# Altium schematic sheet schematic_GSM_01.SchDoc
size 381 x 241 mm; SheetNumber: 1
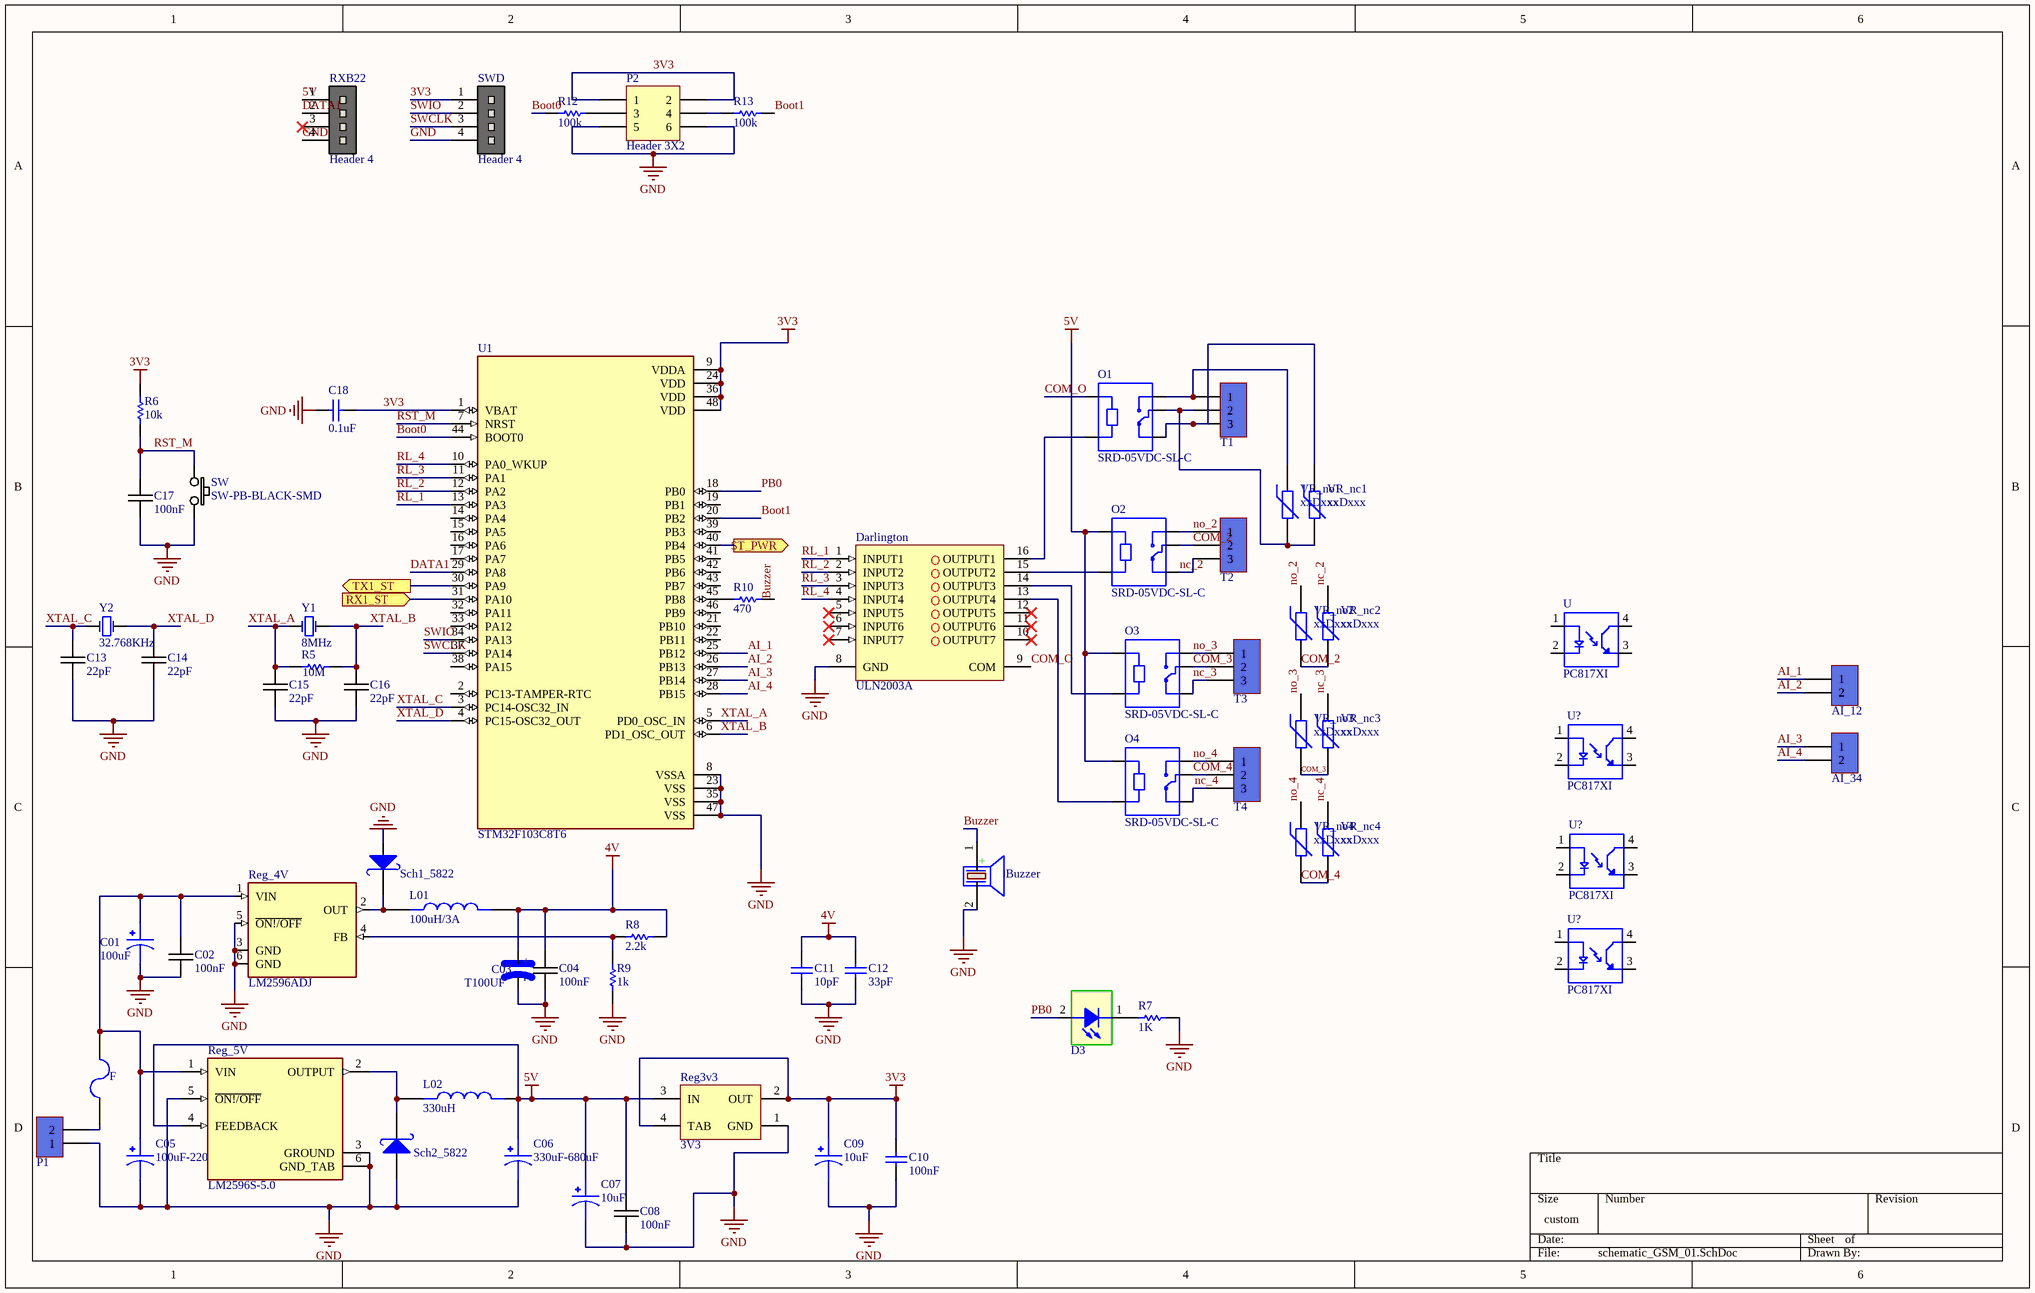
[diagram p0: schematic_GSM_01.SchDoc]

## Parts
(Parts that share a designator on the sheet are numbered #1, #2 ... from top to bottom, then left to right.)
AI_12  KF301_Terminal  [KF301 2PIN]  (value not drawn)
AI_34  KF301_Terminal  [KF301 2PIN]  (value not drawn)
Buzzer  (no value)  [BUZZER 7.62mm DC]
C01  100uF  [CAPAE1050X1050N]
C02  100nF  [0805C-TBD]
C03  T100UF  [AVX-B]
C04  100nF  [0805C-TBD]
C05  100uF-220uF  [CAPAE1050X1050N]
C06  330uF-680uF  [CAPAE1050X1050N]
C07  10uF  [CAPAE1050X1050N]
C08  100nF  [0805C-TBD]
C09  10uF  [CAPAE1050X1050N]
C10  100nF  [CAPC3413X12N]
C11  10pF  [CAPC3413X12N]
C12  33pF  [CAPC3413X12N]
C13  22pF  [0805C-TBD]
C14  22pF  [0805C-TBD]
C15  22pF  [0805C-TBD]
C16  22pF  [0805C-TBD]
C17  100nF  [0805C-TBD]
C18  0.1uF  [CAPC3413X12N]
D3  SMD 1206 LED  [LED 1206]  (value not drawn)
Darlington  ULN2003A  [SO16_N]
F  F=1.0 A  [1206 FUSE]  (value not drawn)
L01  100uH/3A  [IND_SCIHP1367-100M]
L02  330uH  [IND_SCIHP1367-100M]
O1  SRD-05VDC-SL-C  [RELAY_SRD-05VDC-SL-C]
O2  SRD-05VDC-SL-C  [RELAY_SRD-05VDC-SL-C]
O3  SRD-05VDC-SL-C  [RELAY_SRD-05VDC-SL-C]
O4  SRD-05VDC-SL-C  [RELAY_SRD-05VDC-SL-C]
P1  KF301_Terminal  [KF301 2PIN]  (value not drawn)
P2  Header 3X2  [HDR2X3]
R5  10M  [RESC3413X04N]
R6  10k  [RESC3413X04N]
R7  1K  [RESC3413X04N]
R8  2.2k  [RESC3413X04N]
R9  1k  [RESC3413X04N]
R10  470  [RESC3413X04N]
R12  100k  [RESC3413X04N]
R13  100k  [RESC3413X04N]
Reg3v3  3V3  [SOT223]
Reg_4V  LM2596ADJ  [LM2596ADJ]
Reg_5V  LM2596S-5.0  [TO170P1524X483-6N]
RXB22  Header 4  [HDR 1X4]
Sch1_5822  1n5822  [DO-214AB(SMC)]  (value not drawn)
Sch2_5822  1n5822  [DO-214AB(SMC)]  (value not drawn)
SW  SW-PB-BLACK-SMD  [SW-PB-SMD]
SWD  Header 4  [HDR 1X4]
T1  KF301_Terminal  [KF301 3PIN]  (value not drawn)
T2  KF301_Terminal  [KF301 3PIN]  (value not drawn)
T3  KF301_Terminal  [KF301 3PIN]  (value not drawn)
T4  KF301_Terminal  [KF301 3PIN]  (value not drawn)
U  PC817XI  [SOIC254P975X460-4N]
U1  STM32F103C8T6  [QFP50P900X900X160-48N]
U?#1  PC817XI  [SOIC254P975X460-4N]
U?#2  PC817XI  [SOIC254P975X460-4N]
U?#3  PC817XI  [SOIC254P975X460-4N]
VR_nc1  xxDxxx  [07D XXX]
VR_nc2  xxDxxx  [07D XXX]
VR_nc3  xxDxxx  [07D XXX]
VR_nc4  xxDxxx  [07D XXX]
VR_no1  xxDxxx  [07D XXX]
VR_no2  xxDxxx  [07D XXX]
VR_no3  xxDxxx  [07D XXX]
VR_no4  xxDxxx  [07D XXX]
Y1  8MHz  [Crystal SMD]
Y2  32.768KHz  [Crystal SMD]

## Ports
RX1_ST (in), ST_PWR (out), TX1_ST (out)

## Nets
3V3: C09.1 C10.1 C18.2 P2.1 P2.2 R6.1 Reg3v3.2(OUT) Reg3v3.4(TAB) SWD.1 U1.1(VBAT) U1.9(VDDA) U1.24(VDD) U1.36(VDD) U1.48(VDD)
4V: C03.POS C04.1 C11.1 C12.1 L01.2 R8.1
5V: C06.1 C07.1 C08.1 L02.2 O2.A1 O3.A1 O4.A1 Reg3v3.3(IN) Reg_5V.4(FEEDBACK) RXB22.1
GND: Buzzer.2(-) C01.2 C02.2 C03.NEG C04.2 C05.2 C06.2 C07.2 C08.2 C09.2 C10.2 C11.2 C12.2 C13.2 C14.2 C15.2 C16.2 C17.2 C18.1 Darlington.8(GND) P1.1 P2.5 P2.6 R7.2 R9.2 Reg3v3.1(GND) Reg_4V.3(GND) Reg_4V.5(~{ON!/OFF}) Reg_4V.6(GND) Reg_5V.3(GROUND) Reg_5V.5(~{ON!/OFF}) Reg_5V.6(GND_TAB) RXB22.4 Sch1_5822.1(A) Sch2_5822.1(A) SW.2 SWD.4 U1.8(VSSA) U1.23(VSS) U1.35(VSS) U1.47(VSS)
AI_1: AI_12.1 U1.25(PB12)
AI_2: AI_12.2 U1.26(PB13)
AI_3: AI_34.1 U1.27(PB14)
AI_4: AI_34.2 U1.28(PB15)
Boot0: R12.2 U1.44(BOOT0)
Boot1: R13.1 U1.20(PB2)
Buzzer: Buzzer.1(+) R10.2
COM_2: O2.COM T2.2 VR_nc2.2 VR_no2.2
COM_3: O3.COM T3.2 VR_nc3.2 VR_no3.2
COM_4: O4.COM T4.2 VR_nc4.2 VR_no4.2
COM_O: Darlington.9(COM) O1.A1
DATA1: RXB22.2 U1.29(PA8)
nc_2: O2.NC T2.3 VR_nc2.1
nc_3: O3.NC T3.3 VR_nc3.1
nc_4: O4.NC T4.3 VR_nc4.1
no_2: O2.NO T2.1 VR_no2.1
no_3: O3.NO T3.1 VR_no3.1
no_4: O4.NO T4.1 VR_no4.1
PB0: D3.2 U1.18(PB0)
RL_1: Darlington.1(INPUT1) U1.13(PA3)
RL_2: Darlington.2(INPUT2) U1.12(PA2)
RL_3: Darlington.3(INPUT3) U1.11(PA1)
RL_4: Darlington.4(INPUT4) U1.10(PA0_WKUP)
RST_M: C17.1 R6.2 SW.1 U1.7(NRST)
RX1_ST: U1.31(PA10) ; port RX1_ST
ST_PWR: U1.40(PB4) ; port ST_PWR
SWCLK: SWD.3 U1.37(PA14)
SWIO: SWD.2 U1.34(PA13)
TX1_ST: U1.30(PA9) ; port TX1_ST
XTAL_A: C15.1 R5.1 U1.5(PD0_OSC_IN) Y1.1(OSC1)
XTAL_B: C16.1 R5.2 U1.6(PD1_OSC_OUT) Y1.2(OSC2)
XTAL_C: C13.1 U1.3(PC14-OSC32_IN) Y2.1(OSC1)
XTAL_D: C14.1 U1.4(PC15-OSC32_OUT) Y2.2(OSC2)
NetC01_1: C01.1 C02.1 C05.1 F.1 Reg_4V.1(VIN) Reg_5V.1(VIN)
NetD3_1: D3.1 R7.1
NetDarlington_13: Darlington.13(OUTPUT4) O4.A2
NetDarlington_14: Darlington.14(OUTPUT3) O3.A2
NetDarlington_15: Darlington.15(OUTPUT2) O2.A2
NetDarlington_16: Darlington.16(OUTPUT1) O1.A2
NetF_2: F.2 P1.2
NetL01_1: L01.1 Reg_4V.2(OUT) Sch1_5822.2(K)
NetL02_1: L02.1 Reg_5V.2(OUTPUT) Sch2_5822.2(K)
NetO1_COM: O1.COM T1.2 VR_nc1.2 VR_no1.2
NetO1_NC: O1.NC T1.3 VR_nc1.1
NetO1_NO: O1.NO T1.1 VR_no1.1
NetP2_3: P2.3 R12.1
NetP2_4: P2.4 R13.2
NetR8_2: R8.2 R9.1 Reg_4V.4(FB)
NetR10_1: R10.1 U1.45(PB8)

Not connected (* = marked no-connect by the designer): Darlington 5(INPUT5)* 6(INPUT6)* 7(INPUT7)* 10(OUTPUT7)* 11(OUTPUT6)* 12(OUTPUT5)*; RXB22 3*; U 1(A) 2(C) 3(ET) 4(CT); U1 2(PC13-TAMPER-RTC) 14(PA4) 15(PA5) 16(PA6) 17(PA7) 19(PB1) 21(PB10) 22(PB11) 32(PA11) 33(PA12) 38(PA15) 39(PB3) 41(PB5) 42(PB6) 43(PB7) 46(PB9); U?#1 1(A) 2(C) 3(ET) 4(CT); U?#2 1(A) 2(C) 3(ET) 4(CT); U?#3 1(A) 2(C) 3(ET) 4(CT)

## Notes on the sheet
- (in symbol TANTALUM-SMD-100UF-6.3V(AVX-B)) +; -

## Library data of the parts
AI_12 AI_34 P1 = KF301-2Pin_Terminal: Terminal 2 Pin 250VAC 16A; Part. No: KF301 2P; Designer: Abbas Basereh; Link: https://www.aliexpress.com/item/
Buzzer = PIEZO BUZZER: PIEZO BUZZER ACTIVE; Designer: Abbas Basereh; Comment_1: SPEAKER AND BEEP; Design Date: 1395/11/14; ComponentLink2Description: Reference; PackageDescription: THD; Publisher: Abbas Basereh; Mounting Technology: THD; Pin Count: 2; Status: Unreleased
C01 C05 C06 C07 C09 = MAL214699103E3: 100ÂµF 50V Aluminum Electrolytic Capacitors Radial, Can - SMD 1500 Hrs @ 125Â°C; MF: Vishay BC; MP: MAL214699103E3; SnapEDA_Link: https://www.snapeda.com/parts/MAL214699103E3/Vishay%20BC%20Components/view-part/285948/?ref=snap; Value: *; Digi-Key_Part_Number: 4437PHCT-ND; Mouser-Purchase-URL: https://snapeda.com/shop?store=Mouser&id=285948; DigiKey-Purchase-URL: https://snapeda.com/shop?store=DigiKey&id=285948; Package: Radial Vishay BC
C02 C04 C08 C13-C17 = 0805C-100nF-25V-X7R-MUR: CAPACITOR 0805 CERAMIC; Supplier 1: Digi-Key; Supplier Part Number 1: 490-1673-1-ND
C03 = TANTALUM-SMD-100UF-6.3V(AVX-B): 100ÂµF Molded Tantalum Capacitors 6.3V 1411 _3528 Metric_, 1210 1.7Ohm; MF: AVX Interconnect / Elco; MP: TAJB107M006RNJ; Value: *; Package: 1210 AVX Interconnect / Elco; SnapEDA_Link: https://www.snapeda.com/parts/TAJB107M006RNJ/AVX%20Interconnect%20/%20Elco/view-part/105606/?ref=snap; Price: None; Availability: Unavailable
C10-C12 C18 = CAP SMD 0805: CAP 0805; Designer: Abbas Basereh; Desc.: CAP SMD 0805; Data: 16-12-2016
D3 = LED SMD 1206
Darlington = ULN2003A: SEVEN DARLINGTON ARRAYS; Published: 2017-3-2; DatasheetVersion: STMicroelectronics GROUP OF COMPANIES; PackageVersion: 2017-3-2; PackageReference: SO16_N; Publisher: Abbas Basereh; PackageDescription: 16-Pin Small Outline Integrated Circuit 1.27 mm Pitch, IPC High Density; Supplier 1: Digi-Key; Supplier Part Number 1: ULN2003A; Supplier 2: Mouser; Supplier Part Number 2: ULN2003A; ComponentLink1Description: Datasheet; ComponentLink2URL: http://www.st.com
F = Fuse SMD1206: SMD Fuses 1206; Designer: Abbas Basereh; Desc.: SMD Fuses 1206; Data: 16-12-2016
L01 L02 = SCIHP1367-4R7M: High Current Shielded SMD Power Inductor | Inductance 4.7uH | Test Frequency 200KHz | DC Resistance 0.0112? | Saturation Current 25A | Temperature Current 13.5A | Max Height 6.7mm; MF: Signal Transformer; Price: None; Check_prices: https://www.snapeda.com/parts/SCIHP1367-4R7M/Signal%20Transformer/view-part/1550067/?ref=eda; SnapEDA_Link: https://www.snapeda.com/parts/SCIHP1367-4R7M/Signal%20Transformer/view-part/1550067/?ref=snap; Package: Nonstandard Signal Transformers; Availability: Bad; MP: SCIHP1367-4R7M; Value: *
O1-O4 = SRD-05VDC-SL-C: 5V Trigger Relay Module For Arduino And Raspberry Pi 5V Trigger Relay Module For Arduino And Raspberry Pi; MF: Songle Relay; Package: None; Availability: Unavailable; Value: *; MP: SRD-05VDC-SL-C; SnapEDA_Link: https://www.snapeda.com/parts/SRD-05VDC-SL-C/Songle%20Relay/view-part/1029484/?ref=snap; Price: None
P2 = Header 3X2: Header, 3-Pin, Dual row; LatestRevisionDate: 17-Jul-2002; LatestRevisionNote: Re-released for DXP Platform.; Publisher: Altium Limited
R5-R10 R12 R13 = RES 0805 0.125W: RES 0805; Designer: Abbas Basereh; Desc.: RES SMD 0805; Data: 16-12-2016
Reg3v3 = AMS1117-x.x: x.x Volt, 800mA Low-Dropout Linear Regulator, 4-pin SOT-223; Designer: Ali Hafizi; Data: 16-12-2016
Reg_4V = LM2596ADJ: MP: LM2596-ADJ; MF: First Components; SnapEDA_Link: https://www.snapeda.com/parts/LM2596-ADJ/First%20Components/view-part/557542/?ref=snap; Availability: Unavailable; Price: None; Value: *; Package: None
Reg_5V = LM2596S-5.0: SIMPLE SWITCHER&reg; 4.5V to 40V, 3A Low Component Count Step-Down Regulator 5-DDPAK/TO-263; MF: Texas Instruments; MP: LM2596S-5.0/NOPB; DigiKey-Purchase-URL: https://snapeda.com/shop?store=DigiKey&id=15588; Mouser-Purchase-URL: https://snapeda.com/shop?store=Mouser&id=15588; SnapEDA_Link: https://www.snapeda.com/parts/LM2596S-5.0/NOPB/Texas%20Instruments/view-part/15588/?ref=snap; Price: None; Value: *; Availability: Good; Texas_Instruments-Purchase-URL: https://snapeda.com/shop?store=Texas+Instruments&id=15588; Package: TO-263-5 Texas Instruments
RXB22 SWD = Header 4: Header, 4-Pin
Sch1_5822 Sch2_5822 = 1N5822 SMD: Schottky Rectifiers; Part. No: SS34; Manufacturer: ON Semiconductor/Fairchild; Designer: Abbas Basereh; Link: https://www.aliexpress.com/item/Free-shipping-100pcs-1n5822-sma-smd-do-214ac-Schottky-diode-ss34/32337482329.html?spm=2114.01010208.3.1.zLZDsP&ws_ab_test=searchweb0_0,searchweb201602_4_10065_10068_10084_10083_10080_10082_10081_10060_10061_10062_10056_10055_10054_10059_10099_10078_10079_427_10073_10103_10102_10096_10052_10050_10051,searchweb201603_4&btsid=6e50dc92-ac69-45bc-a19e-209af19ce602; Link: http://www.tme.eu/en/details/ss34/smd-schottky-diodes/vishay/ss34-e357t/; Link: http://www.digikey.com/product-detail/en/on-semiconductor-fairchild/SS34/SS34FSCT-ND/2094459; Data: 16-12-2016
SW = SW-PB-BLACK-SMD: PUSHBUTTON SWITCH 6MM SMD
T1-T4 = KF301-3Pin_Terminal: Terminal 3 Pin 250VAC 16A; Part. No: KF301 3P; Designer: Abbas Basereh; Link: https://www.aliexpress.com/item/
U U?#1-U?#3 = PC817XI: Optoisolator Transistor Output 5000Vrms 1 Channel 4-SMD; MF: Sharp Microelectronics; Price: None; Package: SMD-4 Sharp; Value: *; MP: PC817XI; Availability: Unavailable; SnapEDA_Link: https://www.snapeda.com/parts/PC817XI/Sharp%20Microelectronics/view-part/494182/?ref=snap
U1 = STM32F103C8T6: ARMÂ® CortexÂ®-M3 STM32F1 Microcontroller IC 32-Bit 72MHz 64KB _64K x 8_ FLASH; MF: STMicroelectronics; Price: None; Package: LQFP-48 STMicroelectronics; Value: *; MP: STM32F103C8T6; Availability: Unavailable; SnapEDA_Link: https://www.snapeda.com/parts/STM32F103C8T6/STMicroelectronics/view-part/52195/?ref=snap
VR_nc1-VR_nc4 VR_no1-VR_no4 = VARISTOR (VDR): VARISTORS; Manufacturer: china-canada-philipina; Designer: Abbas Basereh; Models: MOV-VDR-COV; Data: 2017-1-5; Link: digikey.com; VALUE: xxDxxx; PUBLISHER: ABBAS BASEREH
Y1 Y2 = XTAL: XTAL Crystal; Designer: ABBAS BASEREH; Value: 12 MHz; Design Date: 2017-1-3; ComponentLink1Description: Datasheet; ComponentLink2Description: Reference; Mounting Technology: Surface Mount\Through-Hole; Status: Unreleased